# EAGLE design Circular_Touch_Pad_V1 (EAGLE 9.5.2)
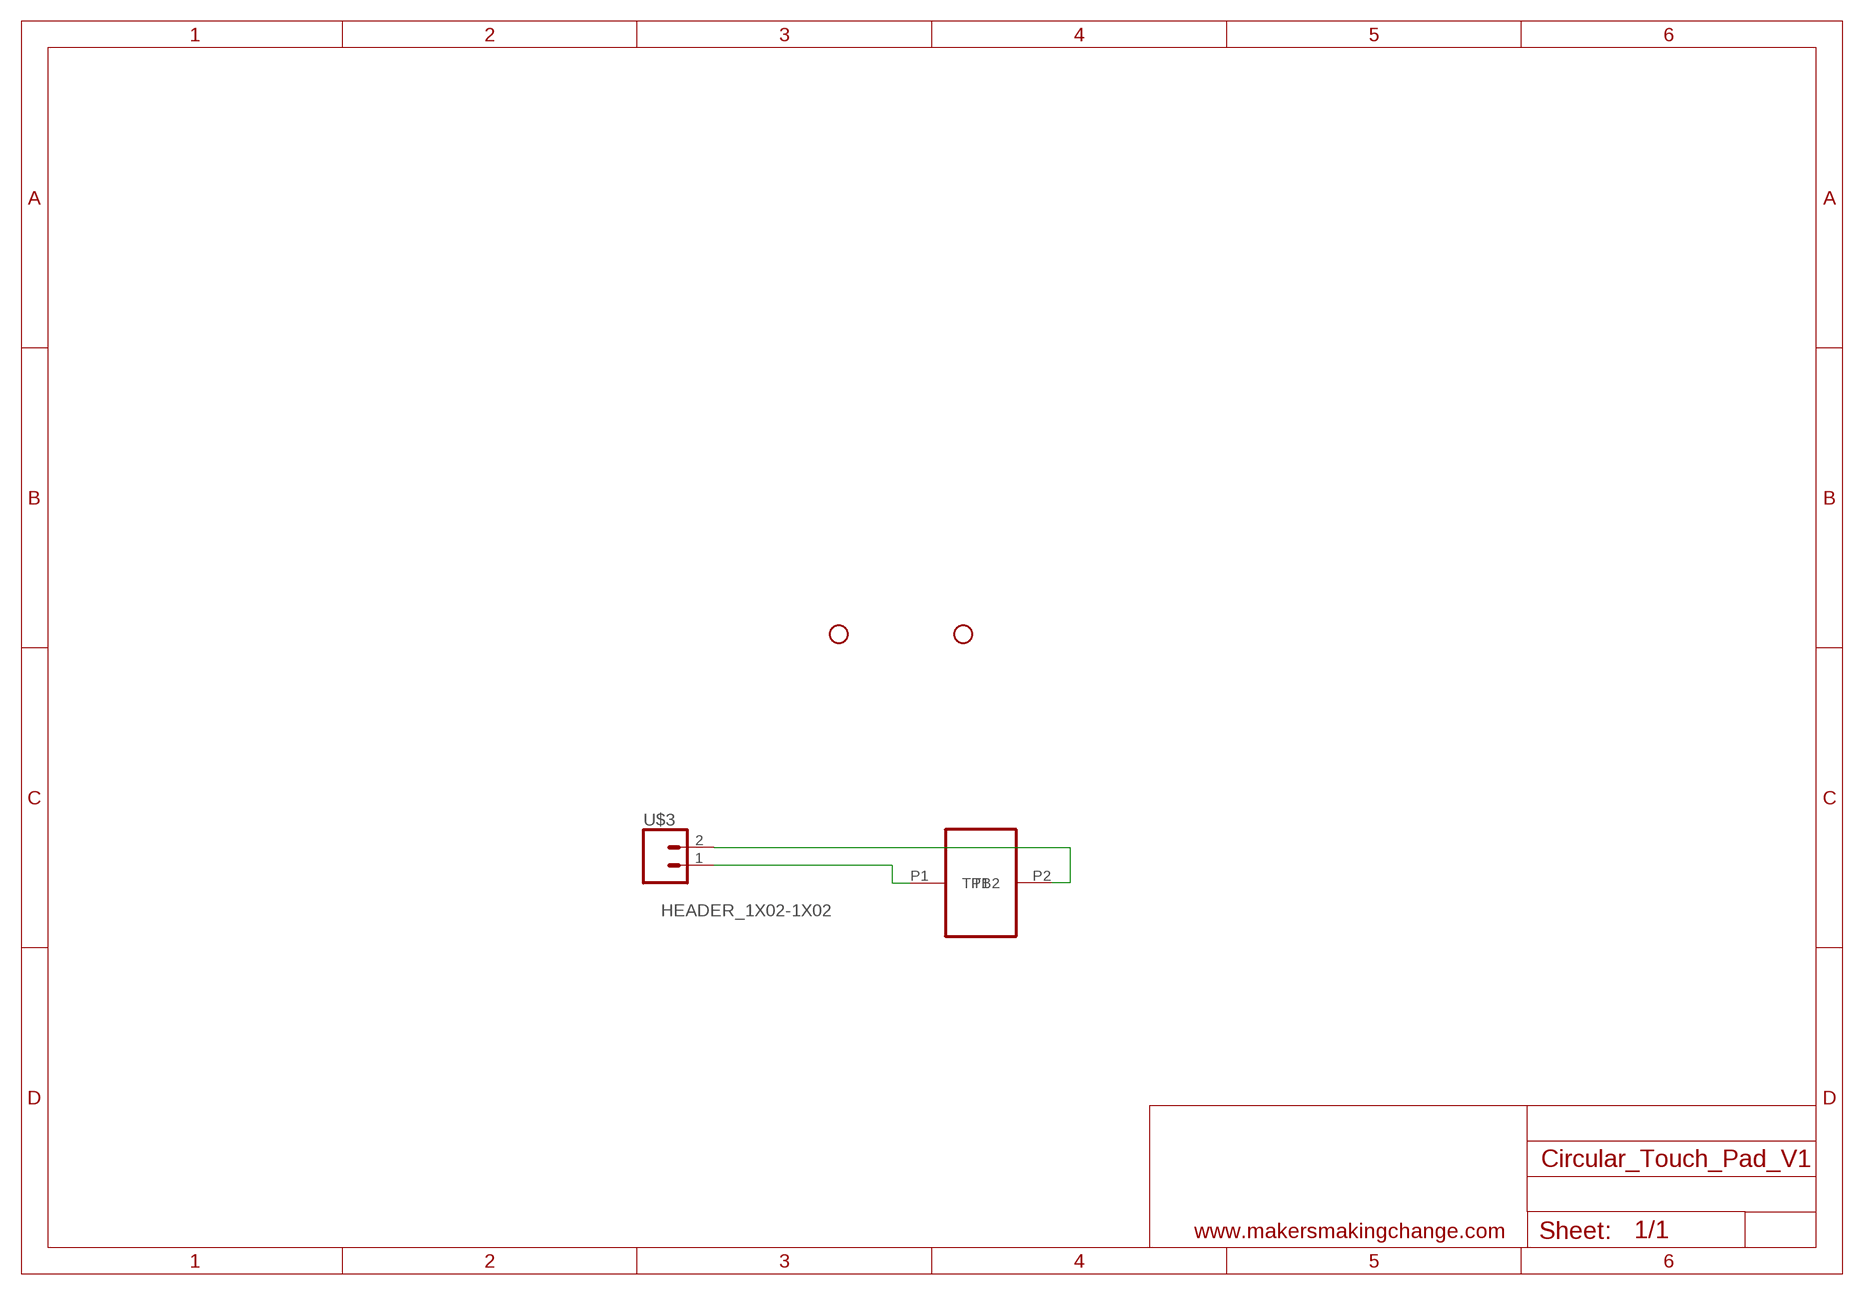
[diagram p0: schematic, sheet 1]

## Parts
H1  STAND-OFF-  [STAND-OFF]
H2  STAND-OFF-  [STAND-OFF]
U$1  TOUCHPAD-CIRCLE  [TOUCHPAD-CIRCLE-VER1]
U$3  HEADER_1X02-1X02  [1X02]

## Nets
N$1: U$1.P1(TP1) U$3.1
N$2: U$1.P2(TB2) U$3.2

## Notes on the sheet
- www.makersmakingchange.com

## Library data of the parts
H1 H2 = MMC Eagle:STAND-OFF-
U$1 = MMC Eagle:TOUCHPAD-
U$3 = MMC Eagle:HEADER_1X02-

## Board
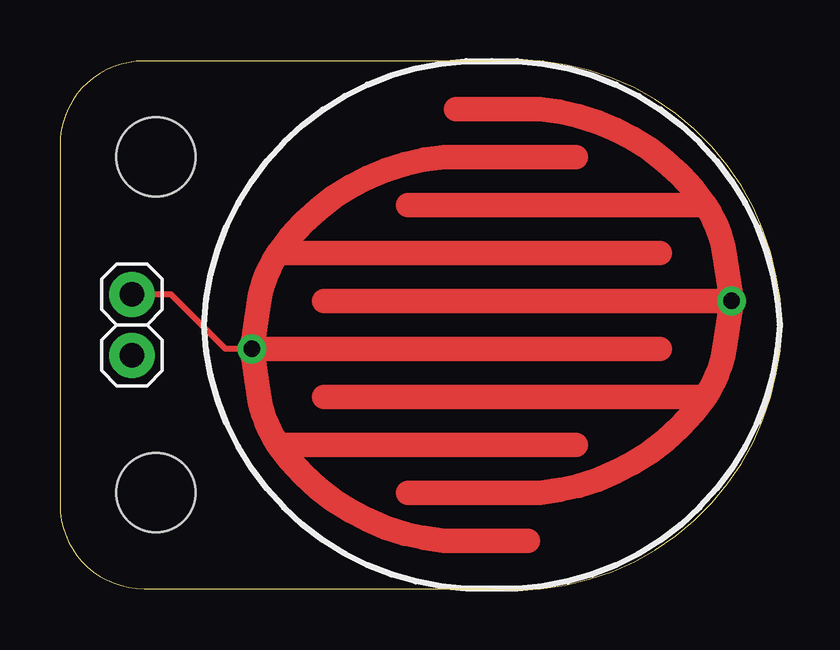
[diagram p1: board, top side]
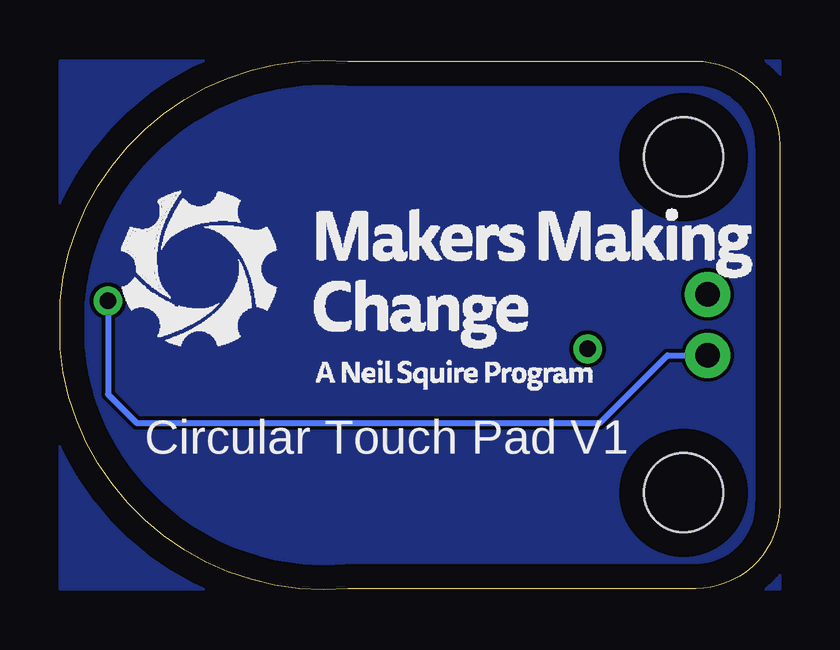
[diagram p2: board, bottom side, seen from below]

Size 30 x 22.09 mm. Coordinates in mm from the lower left corner, seen from the top.
Outline: 0,3.55 arc90 3.5,0.05 18,0.05 arc90 30,10.05 30,12.05 arc90 18,22.05 3.5,22.05 arc90 0,18.55 0,3.55
Copper layers (1*16): Top 0.035mm / dielectric 1.5mm / Bottom 0.035mm
Design rules "default *": minimum track width 6mil, minimum drill 0.45mm, track to track 6mil, track to pad 6mil, pad to pad 6mil, via to via 6mil, smd to smd 6mil, copper to edge 40mil, drill to drill 6mil, minimum pad ring 10mil, minimum via ring 8mil, stop-mask expansion 4mil, vias tented up to drill 0mil, thermal gap 10mil

### Footprints (pad centres in the part's own frame; a part is rotated, then mirrored left to right if it is on the bottom)
STAND-OFF = hole 3.302: 0,0
TOUCHPAD-CIRCLE-VER1 = drill 0.7: P1 -10,-1; P2 10,1
1X02 = drill 1.016 pad 1.88: 1 -1.27,0; 2 1.27,0

### Placement (x,y rotation side)
H1  4,4.05 0 top
H2  4,18.05 0 top
U$1  18,11.05 0 top
U$3  3,11.05 270 top

### Tracks (layer width: path | path; a pad name or v marks a point on that pad's centre or on a via)
GND
  pour Bottom: 0,0.05 0,22.05 30,22.05 30,0.05
N$1
  Top 0.254: U$1.P1 6.9,10.05 4.63,12.32 U$3.1
N$2
  Bottom 0.254: U$1.P2 28,8.15 26.8,6.95 7.5,6.95 4.67,9.78 U$3.2

### Text on the board
bPlace: Circular Touch Pad V1